# Altium schematic sheet panda.SchDoc
size A4
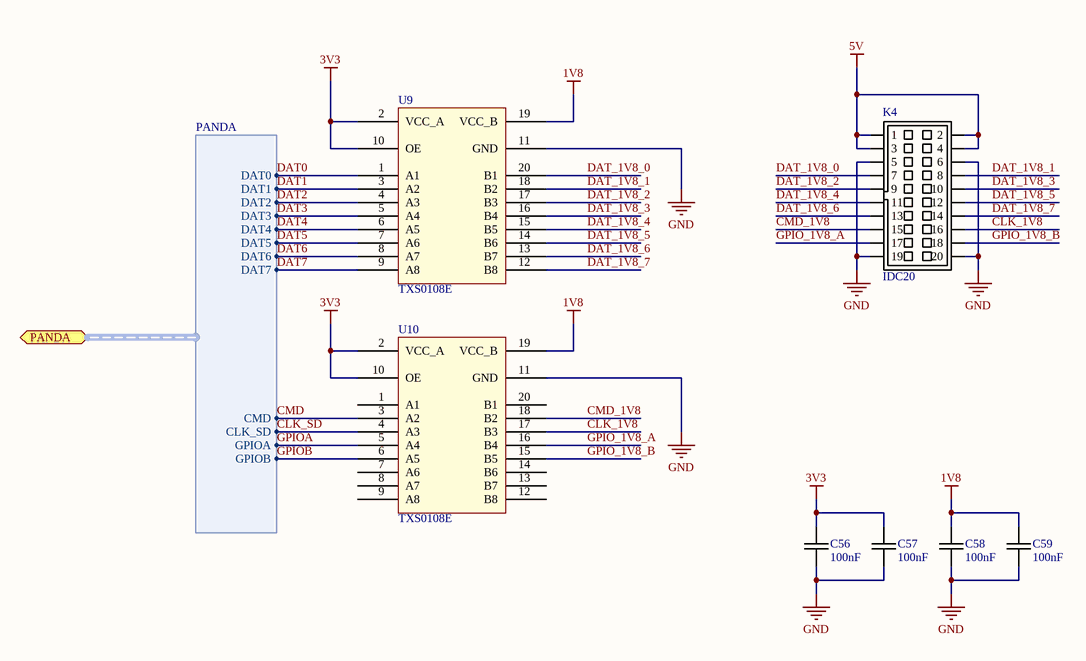
[diagram p0: panda.SchDoc]

## Parts
C56  100nF  [0603C-GENERIC]
C57  100nF  [0603C-GENERIC]
C58  100nF  [0603C-GENERIC]
C59  100nF  [0603C-GENERIC]
K4  IDC20  [IDC20-B]
U9  TXS0108E  [TSOP65P640-20BM]
U10  TXS0108E  [TSOP65P640-20BM]

## Ports
PANDA (harness PANDA)

## Harnesses
PANDA: DAT0, DAT1, DAT2, DAT3, DAT4, DAT5, DAT6, DAT7, CMD, CLK_SD, GPIOA, GPIOB

## Nets
1V8: C58.1 C59.1 U9.19(VCC_B) U10.19(VCC_B)
3V3: C56.1 C57.1 U9.2(VCC_A) U9.10(OE) U10.2(VCC_A) U10.10(OE)
5V: K4.1 K4.2 K4.3 K4.4
GND: C56.2 C57.2 C58.2 C59.2 K4.5 K4.6 K4.19 K4.20 U9.11(GND) U10.11(GND)
CLK_1V8: K4.16 U10.17(B3)
CLK_SD: U10.4(A3) ; port PANDA.CLK_SD
CMD: U10.3(A2) ; port PANDA.CMD
CMD_1V8: K4.15 U10.18(B2)
DAT0: U9.1(A1) ; port PANDA.DAT0
DAT1: U9.3(A2) ; port PANDA.DAT1
DAT2: U9.4(A3) ; port PANDA.DAT2
DAT3: U9.5(A4) ; port PANDA.DAT3
DAT4: U9.6(A5) ; port PANDA.DAT4
DAT5: U9.7(A6) ; port PANDA.DAT5
DAT6: U9.8(A7) ; port PANDA.DAT6
DAT7: U9.9(A8) ; port PANDA.DAT7
DAT_1V8_0: K4.7 U9.20(B1)
DAT_1V8_1: K4.8 U9.18(B2)
DAT_1V8_2: K4.9 U9.17(B3)
DAT_1V8_3: K4.10 U9.16(B4)
DAT_1V8_4: K4.11 U9.15(B5)
DAT_1V8_5: K4.12 U9.14(B6)
DAT_1V8_6: K4.13 U9.13(B7)
DAT_1V8_7: K4.14 U9.12(B8)
GPIO_1V8_A: K4.17 U10.16(B4)
GPIO_1V8_B: K4.18 U10.15(B5)
GPIOA: U10.5(A4) ; port PANDA.GPIOA
GPIOB: U10.6(A5) ; port PANDA.GPIOB

Not connected (* = marked no-connect by the designer): U10 1(A1) 7(A6) 8(A7) 9(A8) 12(B8) 13(B7) 14(B6) 20(B1)

## Library data of the parts
C56-C59 = 0603C-100NF-50V-X7R-TDK: GENERIC CAPACITOR NON POLARISED 0603; Manufacturer Part Number: C1608X7R1H103K; Manufacturer: TDK Corporation; Temperature Coefficient: X7R; Tolerance: ±10%; Voltage - Rated: 50V; Capacitance: 10000pF; Description: CAP CER 10000PF 50V X7R 10% 0603; Reel: C68; RoHS: RoHS Compliant; Lead Spacing: -; Package / Case: 0603 (1608 metric); Features: General Purpose; Packaging: Tape & Reel (TR); Thickness: 0.80mm; Operating Temperature: -55°C ~ 125°C; Mounting Type: Surface Mount, MLCC; Category: Capacitors; Supplier 1: Digi-Key; Supplier Part Number 1: 445-1314-2-ND
K4 = IDC20: BOXHEADER 20 PIN; Manufacturer: Assmann Electronics Inc; Manufacturer Part Number: AWHW20G-0202-T-R; Description: CONN HEADER LOW-PRO 20POS GOLD; Number of Positions: 20; Number of Positions Loaded: All; Pitch: 0.100" (2.54mm); Connector Type: Header, Shrouded; Supplier 1: Digi-Key; Supplier Part Number 1: HRP20H-ND; Contact Type: Male Pin; Fastening Type: -; Contact Mating Length: -; Contact Finish Thickness: Flash; Number of Rows: 2; RoHS: RoHS Compliant; Category: Connectors, Interconnects; Packaging: Tray; Mounting Type: Through Hole; Contact Finish: Gold; Color: Gray; Features: -; Supplier: Digi-Key; Row Spacing: 0.100" (2.54mm); Supplier Part Number: HRP20H-ND; Termination: Solder